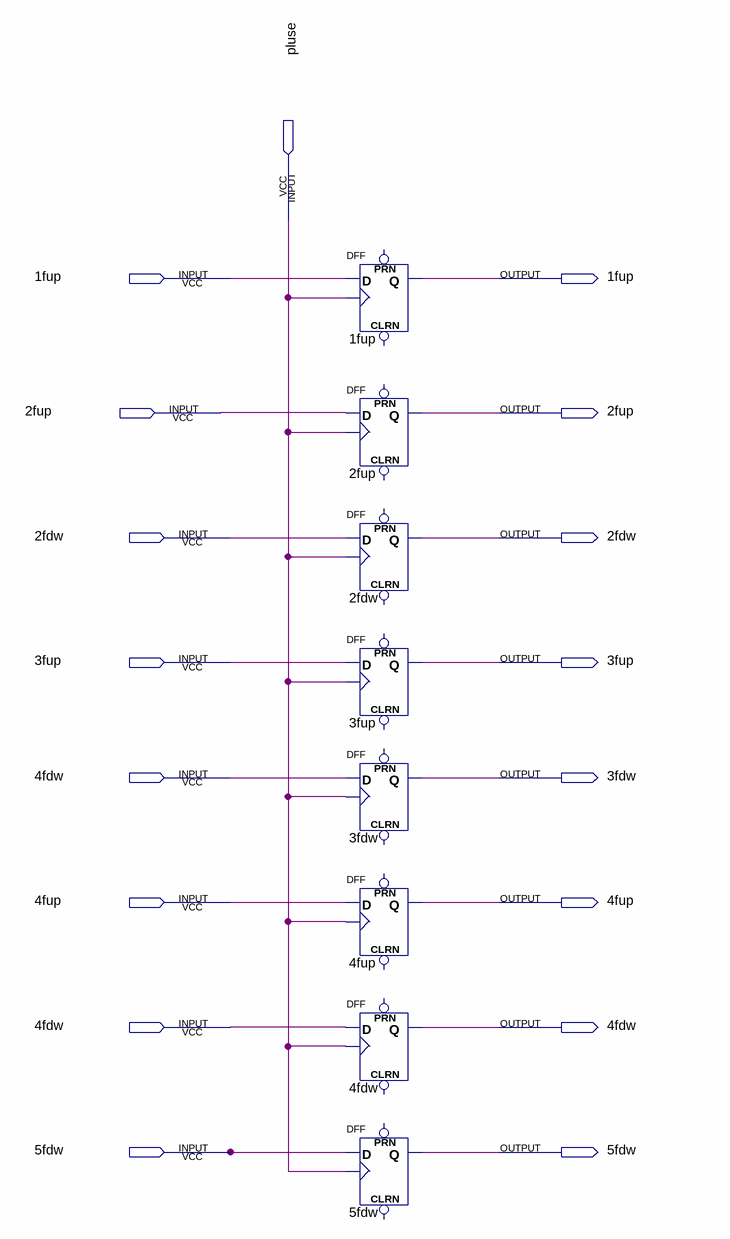
[diagram p0: schematic sheet]
// Quartus schematic outsideinput.bdf as structural Verilog: 8 symbols, 17 pins
module outsideinput (
  input  pluse,
  inout  \1fup ,
  inout  \2fup ,
  inout  \2fdw ,
  inout  \3fup ,
  inout  \4fdw ,
  inout  \4fup ,
  inout  \5fdw ,
  output \3fdw 
);

  DFF u_1fup (.CLK(pluse), .D(\1fup ), .Q(\1fup ));  // open: CLRN, PRN
  DFF u_2fup (.CLK(pluse), .D(\2fup ), .Q(\2fup ));  // open: CLRN, PRN
  DFF u_2fdw (.CLK(pluse), .D(\2fdw ), .Q(\2fdw ));  // open: CLRN, PRN
  DFF u_3fup (.CLK(pluse), .D(\3fup ), .Q(\3fup ));  // open: CLRN, PRN
  DFF u_3fdw (.CLK(pluse), .D(\4fdw ), .Q(\3fdw ));  // open: CLRN, PRN
  DFF u_4fup (.CLK(pluse), .D(\4fup ), .Q(\4fup ));  // open: CLRN, PRN
  DFF u_4fdw (.CLK(pluse), .D(\4fdw ), .Q(\4fdw ));  // open: CLRN, PRN
  DFF u_5fdw (.CLK(pluse), .D(\5fdw ), .Q(\5fdw ));  // open: CLRN, PRN
endmodule
